# EAGLE schematic gms_pcb (EAGLE 9.6.2)
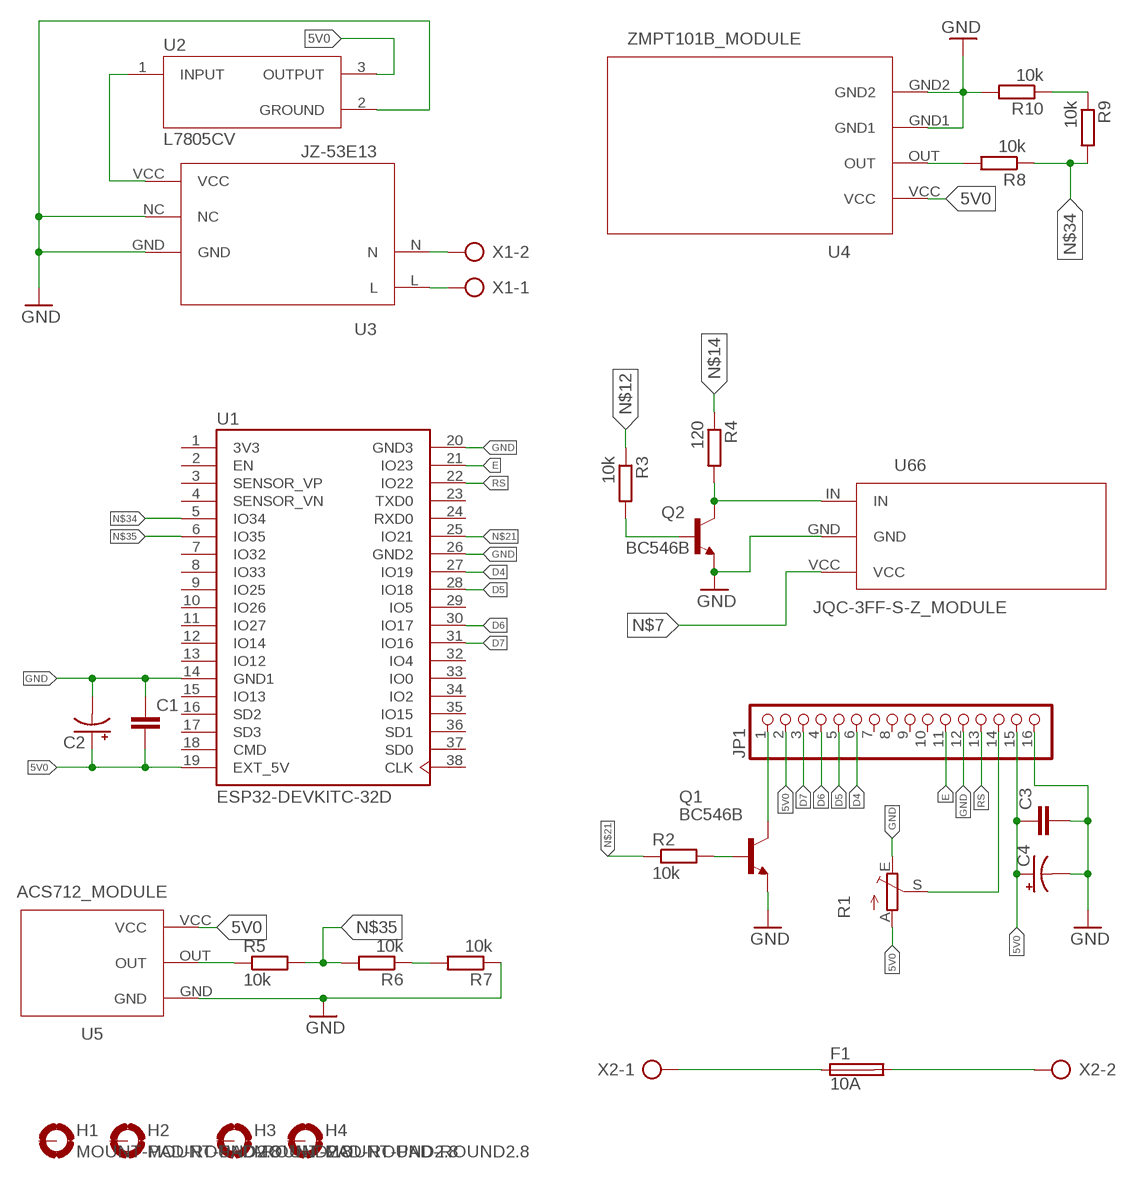
[diagram p0: schematic, sheet 1]

## Parts
C1  C-EU025-025X050  [C025-025X050]
C2  CPOL-USE2.5-6  [E2,5-6]
C3  C-EU025-025X050  [C025-025X050]
C4  CPOL-USE2.5-6  [E2,5-6]
F1  10A  SH25  [SH25]
H1  MOUNT-PAD-ROUND2.8  [2,8-PAD]
H2  MOUNT-PAD-ROUND2.8  [2,8-PAD]
H3  MOUNT-PAD-ROUND2.8  [2,8-PAD]
H4  MOUNT-PAD-ROUND2.8  [2,8-PAD]
JP1  PINHD-1X16  [1X16]
Q1  BC546B  [TO92-EBC]
Q2  BC546B  [TO92-EBC]
R1  TRIM_EU-CA6V  [CA6V]
R2  10k  R-EU_0204/7  [0204/7]
R3  10k  R-EU_0204/7  [0204/7]
R4  120  R-EU_0204/7  [0204/7]
R5  10k  R-EU_0204/7  [0204/7]
R6  10k  R-EU_0204/7  [0204/7]
R7  10k  R-EU_0204/7  [0204/7]
R8  10k  R-EU_0204/7  [0204/7]
R9  10k  R-EU_0204/7  [0204/7]
R10  10k  R-EU_0204/7  [0204/7]
U1  ESP32-DEVKITC-32D  [MODULE_ESP32-DEVKITC-32D]
U2  L7805CV  [TO255P1040X460X1968-3]
U3  JZ-53E13  [JZ-53E13]
U4  ZMPT101B_MODULE  [ZMPT101B_MODULE]
U5  ACS712_MODULE  [ACS712_MODULE]
U66  JQC-3FF-S-Z_MODULE  [JQC-3FF-S-Z_MOUDLE]
X1  AK500/2  [AK500/2]
X2  AK500/2  [AK500/2]

## Nets
5V0: C1.2 C2.+ C3.1 C4.+ JP1.2 JP1.15 R1.A U1.19(EXT_5V) U2.3(OUTPUT) U4.VCC U5.VCC
12V0: U2.1(INPUT) U3.VCC
D4: JP1.6 U1.27(IO19)
D5: JP1.5 U1.28(IO18)
D6: JP1.4 U1.30(IO17)
D7: JP1.3 U1.31(IO16)
E: JP1.11 U1.21(IO23)
GND: C1.1 C2.- C3.2 C4.- JP1.12 JP1.16 Q1.E Q2.E R1.E R7.1 R10.2 U1.14(GND1) U1.20(GND3) U1.26(GND2) U2.2(GROUND) U3.GND U3.NC U4.GND1 U4.GND2 U5.GND U66.GND
L2: F1.1 X2.1
N2: F1.2 X2.2
N$1: Q2.C R4.2 U66.IN
N$2: JP1.14 R1.S
N$3: R8.2 U4.OUT
N$4: U3.N X1.2
N$5: JP1.1 Q1.C
N$6: Q1.B R2.2
N$7: U66.VCC
N$8: Q2.B R3.2
N$9: R9.1 R10.1
N$10: R6.1 R7.2
N$11: U3.L X1.1
N$12: R3.1
N$13: R5.1 U5.OUT
N$14: R4.1
N$21: R2.1 U1.25(IO21)
N$34: R8.1 R9.2 U1.5(IO34)
N$35: R5.2 R6.2 U1.6(IO35)
RS: JP1.13 U1.22(IO22)
Unconnected: H1.B2,8(MOUNT) H2.B2,8(MOUNT) H3.B2,8(MOUNT) H4.B2,8(MOUNT) JP1.7 JP1.8 JP1.9 JP1.10 U1.2(EN) U1.3(SENSOR_VP) U1.4(SENSOR_VN) U1.7(IO32) U1.8(IO33) U1.9(IO25) U1.10(IO26) U1.11(IO27) U1.12(IO14) U1.13(IO12) U1.15(IO13) U1.16(SD2) U1.17(SD3) U1.18(CMD) U1.23(TXD0) U1.24(RXD0) U1.29(IO5) U1.32(IO4) U1.33(IO0) U1.34(IO2) U1.35(IO15) U1.36(SD1) U1.37(SD0) U1.38(CLK)

## Power pins joined to a net without a drawn wire
3V3: U1.1(3V3)

## Library data of the parts
C1 C3 = rcl:C-EU: CAPACITOR, European symbol; SPICEPREFIX: C
C2 C4 = rcl:CPOL-US: POLARIZED CAPACITOR, American symbol; SPICEPREFIX: C
F1 = fuse:SH25: FUSE HOLDER grid 25 mm, OGN0031 8211, Schurter (Buerklin); MF: SCHURTER; MPN: 0031.8211; OC_FARNELL: 1162741; OC_NEWARK: 96B9380
H1-H4 = holes:MOUNT-PAD-ROUND: MOUNTING PAD, round
JP1 = pinhead:PINHD-1X16: PIN HEADER
Q1 Q2 = transistor-npn:BC546*: NPN Transistor
R1 = pot:TRIM_EU-: POTENTIOMETER
R2-R10 = rcl:R-EU_: RESISTOR, European symbol; SPICEPREFIX: R
U1 = ESP32-DEVKITC-32D:ESP32-DEVKITC-32D: Eval Board For Esp-Wroom-32 Check availability <https://pricing.snapeda.com/parts/ESP32-DEVKITC-32D/Espressif%20Systems/view-part?ref=eda>; AVAILABILITY: In Stock; DESCRIPTION: WiFi Development Tools (802.11) ESP32 General Development Kit, ESP32-WROOM-32D on the board; MF: Espressif Systems; MP: ESP32-DEVKITC-32D; PACKAGE: None; PRICE: None; PURCHASE-URL: https://pricing.snapeda.com/search/part/ESP32-DEVKITC-32D/?ref=eda
U2 = L7805CV:L7805CV: Standard Regulator Pos 5V 1.5A 3-Pin(3+Tab) TO-220 Standard Regulator Pos 5V 1.5A 3-Pin(3+Tab) TO-220 Check availability <https://pricing.snapeda.com/parts/L7805CV/STMicroelectronics/view-part?ref=eda>; AVAILABILITY: In Stock; DESCRIPTION: Linear Voltage Regulator IC Positive Fixed 1 Output 1.5A TO-220; MF: STMicroelectronics; MP: L7805CV; PACKAGE: TO-220-3 ON Semiconductor; PRICE: None; PURCHASE-URL: https://pricing.snapeda.com/search/part/L7805CV/?ref=eda
U3 = Arduino_Modules:JZ-53E13
U4 = Arduino_Modules:ZMPT101B_MODULE
U5 = Arduino_Modules:ACS712_MODULE
U66 = Arduino_Modules:JQC-3FF-S-Z_MODULE
X1 X2 = con-ptr500:AK500/2: CONNECTOR; OC_FARNELL: unknown; OC_NEWARK: unknown